# EAGLE design basic (EAGLE 9.6.2)
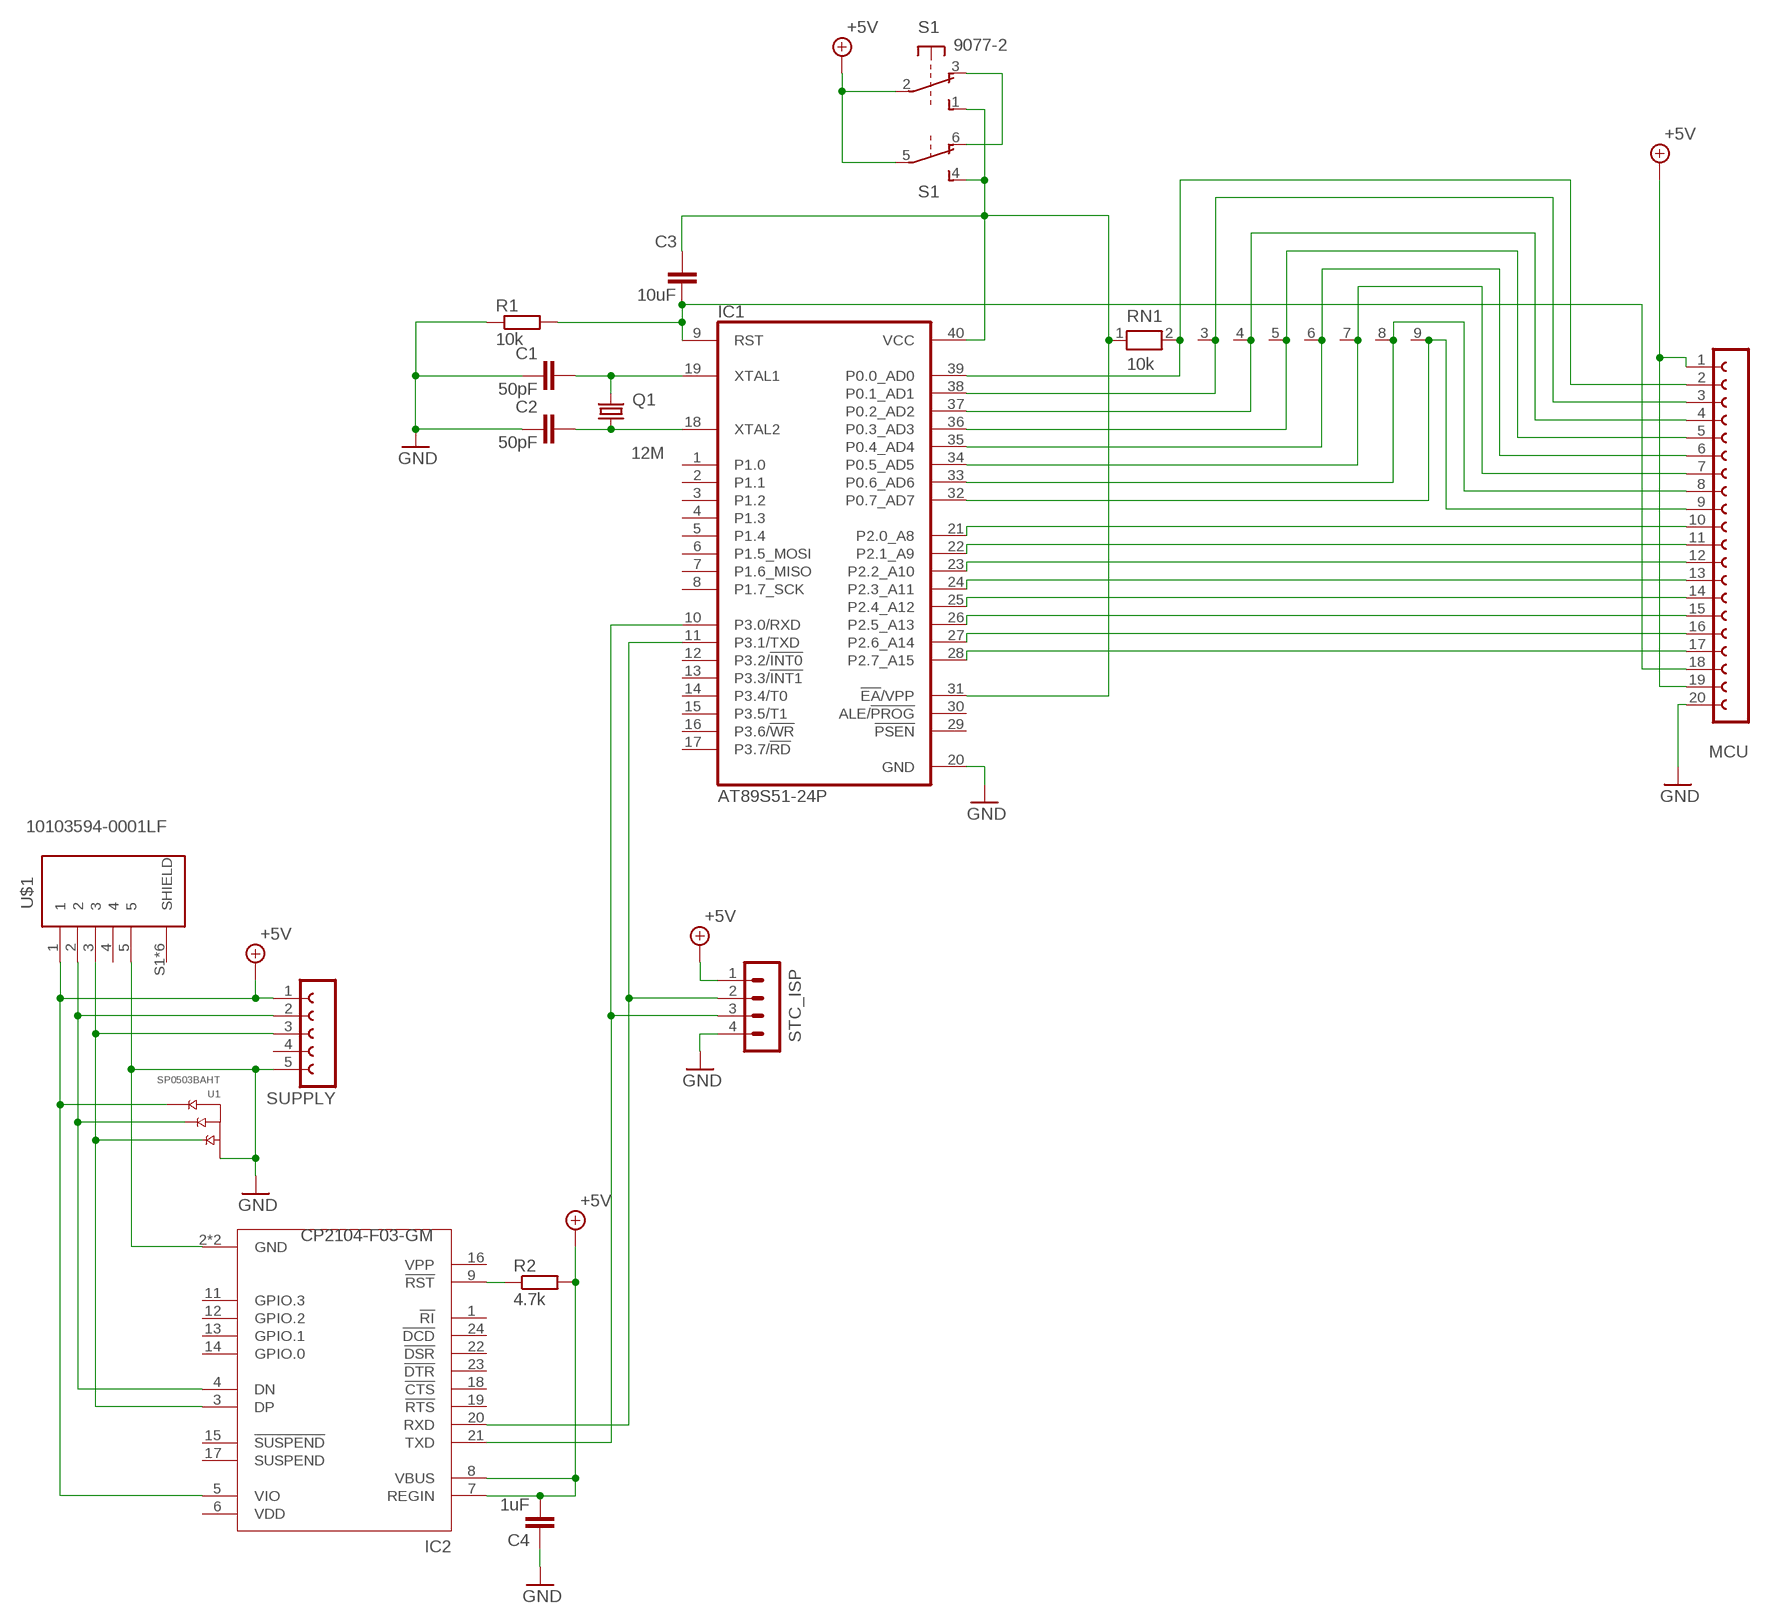
[diagram p0: schematic, sheet 1]

## Parts
C1  50pF  C-EU050-025X075  [C050-025X075]
C2  50pF  C-EU050-025X075  [C050-025X075]
C3  10uF  C-EU025-025X050  [C025-025X050]
C4  1uF  C-EU025-025X050  [C025-025X050]
IC1  AT89S51-24P  [DIL40]
IC2  CP2104-F03-GM  [QFN50P400X400X80-25N]
MCU  FE20-1  [FE20]
Q1  12M  CRYSTALHC49U70  [HC49U70]
R1  10k  R-EU_0207/10  [0207/10]
R2  4.7k  R-EU_0207/10  [0207/10]
RN1  10k  RN08  [RN-9]
S1  9077-2  [9077-2]
STC_ISP  MA04-1  [MA04-1]
SUPPLY  FE05-1  [FE05-1]
U1  SP0503BAHT  [SOT143]
U$1  10103594-0001LF  [FCI_10103594-0001LF]

## Nets
+5V: C4.2 IC2.5(VIO) IC2.7(REGIN) IC2.8(VBUS) MCU.1 MCU.19 R2.2 S1.2(1:P) S1.5(2:P) STC_ISP.1 SUPPLY.1 U1.4(C) U$1.1
GND: C1.1 C2.1 C4.1 IC1.20(GND) IC2.2(GND) IC2.25(GND) MCU.20 R1.1 STC_ISP.4 SUPPLY.5 U1.1(GND) U$1.5
N$1: IC2.4(DN) SUPPLY.2 U1.3(B) U$1.2
N$2: IC1.28(P2.7_A15) MCU.17
N$3: C1.2 IC1.19(XTAL1) Q1.2
N$4: C2.2 IC1.18(XTAL2) Q1.1
N$5: C3.2 IC1.9(RST) MCU.18 R1.2
N$6: IC1.27(P2.6_A14) MCU.16
N$7: IC1.38(P0.1_AD1) MCU.3 RN1.3
N$8: IC1.26(P2.5_A13) MCU.15
N$9: IC1.25(P2.4_A12) MCU.14
N$10: IC1.36(P0.3_AD3) MCU.5 RN1.5
N$11: IC1.35(P0.4_AD4) MCU.6 RN1.6
N$12: IC1.34(P0.5_AD5) MCU.7 RN1.7
N$13: IC1.33(P0.6_AD6) MCU.8 RN1.8
N$14: IC1.32(P0.7_AD7) MCU.9 RN1.9
N$15: IC1.24(P2.3_A11) MCU.13
N$16: IC1.23(P2.2_A10) MCU.12
N$17: IC1.22(P2.1_A9) MCU.11
N$18: IC1.10(P3.0/RXD) IC2.21(TXD) STC_ISP.3
N$19: IC1.21(P2.0_A8) MCU.10
N$20: IC2.3(DP) SUPPLY.3 U1.2(A) U$1.3
N$22: IC1.37(P0.2_AD2) MCU.4 RN1.4
N$23: S1.3(1:O) S1.6(2:O)
N$24: IC2.9(!RST!) R2.1
N$26: IC1.39(P0.0_AD0) MCU.2 RN1.2
N$27: C3.1 IC1.31(!EA!/VPP) IC1.40(VCC) RN1.1 S1.1(1:S) S1.4(2:S)
N$52: IC1.11(P3.1/TXD) IC2.20(RXD) STC_ISP.2
Unconnected: IC1.1(P1.0) IC1.2(P1.1) IC1.3(P1.2) IC1.4(P1.3) IC1.5(P1.4) IC1.6(P1.5_MOSI) IC1.7(P1.6_MISO) IC1.8(P1.7_SCK) IC1.12(P3.2/!INT0) IC1.13(P3.3/!INT1) IC1.14(P3.4/T0) IC1.15(P3.5/T1) IC1.16(P3.6/!WR) IC1.17(P3.7/!RD) IC1.29(!PSEN) IC1.30(ALE/!PROG) IC2.1(!RI) IC2.11(GPIO.3) IC2.12(GPIO.2) IC2.13(GPIO.1) IC2.14(GPIO.0) IC2.15(!SUSPEND!) IC2.16(VPP) IC2.17(SUSPEND) IC2.18(!CTS) IC2.19(!RTS) IC2.22(!DSR) IC2.23(!DTR) IC2.24(!DCD) SUPPLY.4 U$1.4 U$1.S1(SHIELD) U$1.S2(SHIELD) U$1.S3(SHIELD) U$1.S4(SHIELD) U$1.S5(SHIELD) U$1.S6(SHIELD)

## Power pins joined to a net without a drawn wire
VDD: IC2.6(VDD)

## Library data of the parts
C1-C4 = rcl:C-EU: CAPACITOR, European symbol; SPICEPREFIX: C
IC1 = atmel:AT89S51-*: 8-bit Microcontroller with 4K BytesIn-System Programmable Flash Source: http://www.atmel.com/dyn/resources/prod_documents/doc2487.pdf; MPN: AT89S51-24PU; OC_FARNELL: 1095739; OC_NEWARK: 96K6578
IC2 = CP2104:CP2104: Silabs CP2104 USB to UART Bridge; AVAILABILITY: Unavailable; DESCRIPTION: USB Bridge, USB to UART USB 2.0 UART Interface 24-QFN (4x4); MF: Silicon Labs; MP: CP2104; PACKAGE: QFN-24 Silicon Labs; PRICE: None
MCU = con-lsta:FE20-1: FEMALE HEADER; OC_FARNELL: unknown; OC_NEWARK: unknown
Q1 = crystal:CRYSTAL: CRYSTAL; OC_FARNELL: unknown; OC_NEWARK: unknown
R1 R2 = rcl:R-EU_: RESISTOR, European symbol; SPICEPREFIX: R
RN1 = resistor-net:RN08: RESISTOR NETWORK; OC_FARNELL: unknown; OC_NEWARK: unknown
S1 = switch-misc:9077-2: MARQUARDT SWITCH 9077.0200 Distributor: Buerklin <https://www.buerklin.com/default.asp?event=ShowArtikel%2812G2822%29&l=d&jump=ArtNr_12G2822>
STC_ISP = con-lstb:MA04-1: PIN HEADER; OC_FARNELL: unknown; OC_NEWARK: unknown
SUPPLY = con-lsta:FE05-1: FEMALE HEADER; OC_FARNELL: unknown; OC_NEWARK: unknown
U1 = SP0503BAHT:SP0503BAHT; DESCRIPTION: 8.5V Clamp Ipp Tvs Diode Surface Mount SOT-143-4; DIGI-KEY_PART_NUMBER: F2715TR-ND; MF: Littelfuse Inc.; MP: SP0503BAHT; PACKAGE: SOT-143 Littelfuse
U$1 = 10103594-0001LF:10103594-0001LF: Micro Usb, 2.0 Type b, Receptacle, Smt; ARROW_ELECTRONICS-PURCHASE-URL: https://snapeda.com/shop?store=Arrow+Electronics&id=1078241; DESCRIPTION: USB - micro B USB 2.0 Receptacle Connector 5 Position Surface Mount, Right Angle; Through Hole; DIGI-KEY_PART_NUMBER: 609-4050-1-ND; DIGIKEY-PURCHASE-URL: https://snapeda.com/shop?store=DigiKey&id=1078241; MF: Amphenol ICC; MOUSER-PURCHASE-URL: https://snapeda.com/shop?store=Mouser&id=1078241; MP: 10103594-0001LF; PACKAGE: None

## Board
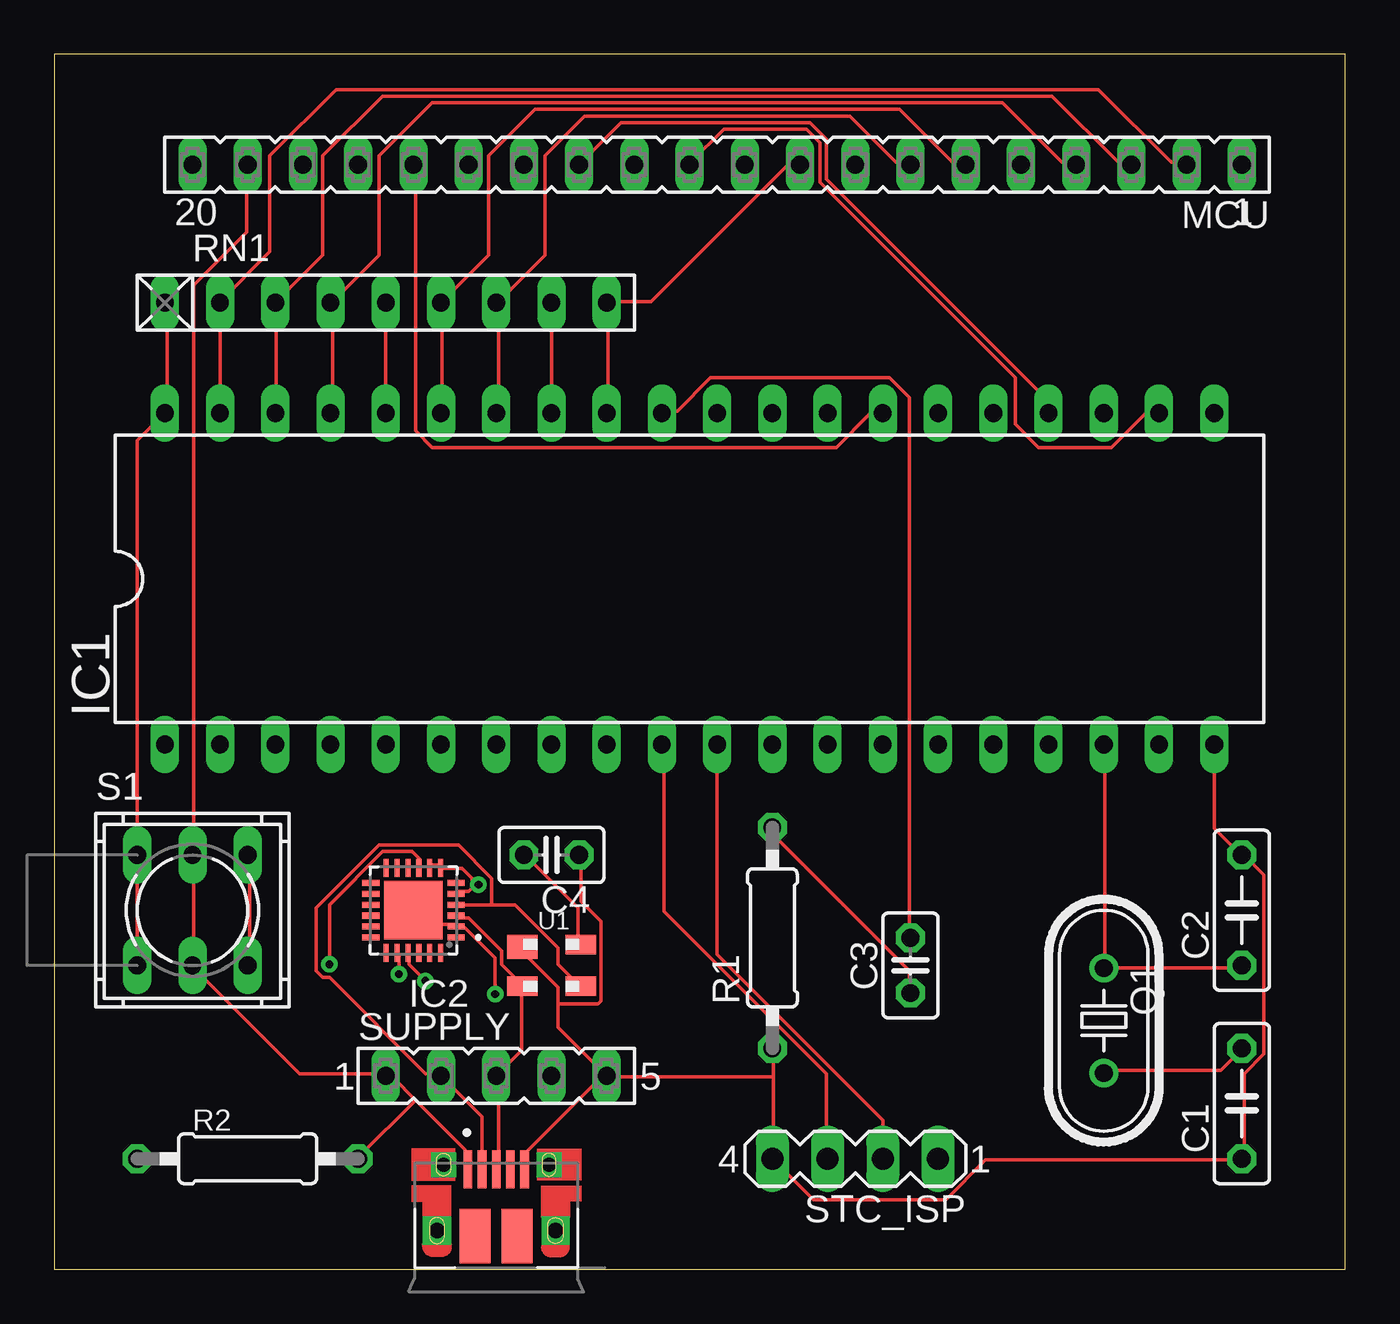
[diagram p1: board, top side]
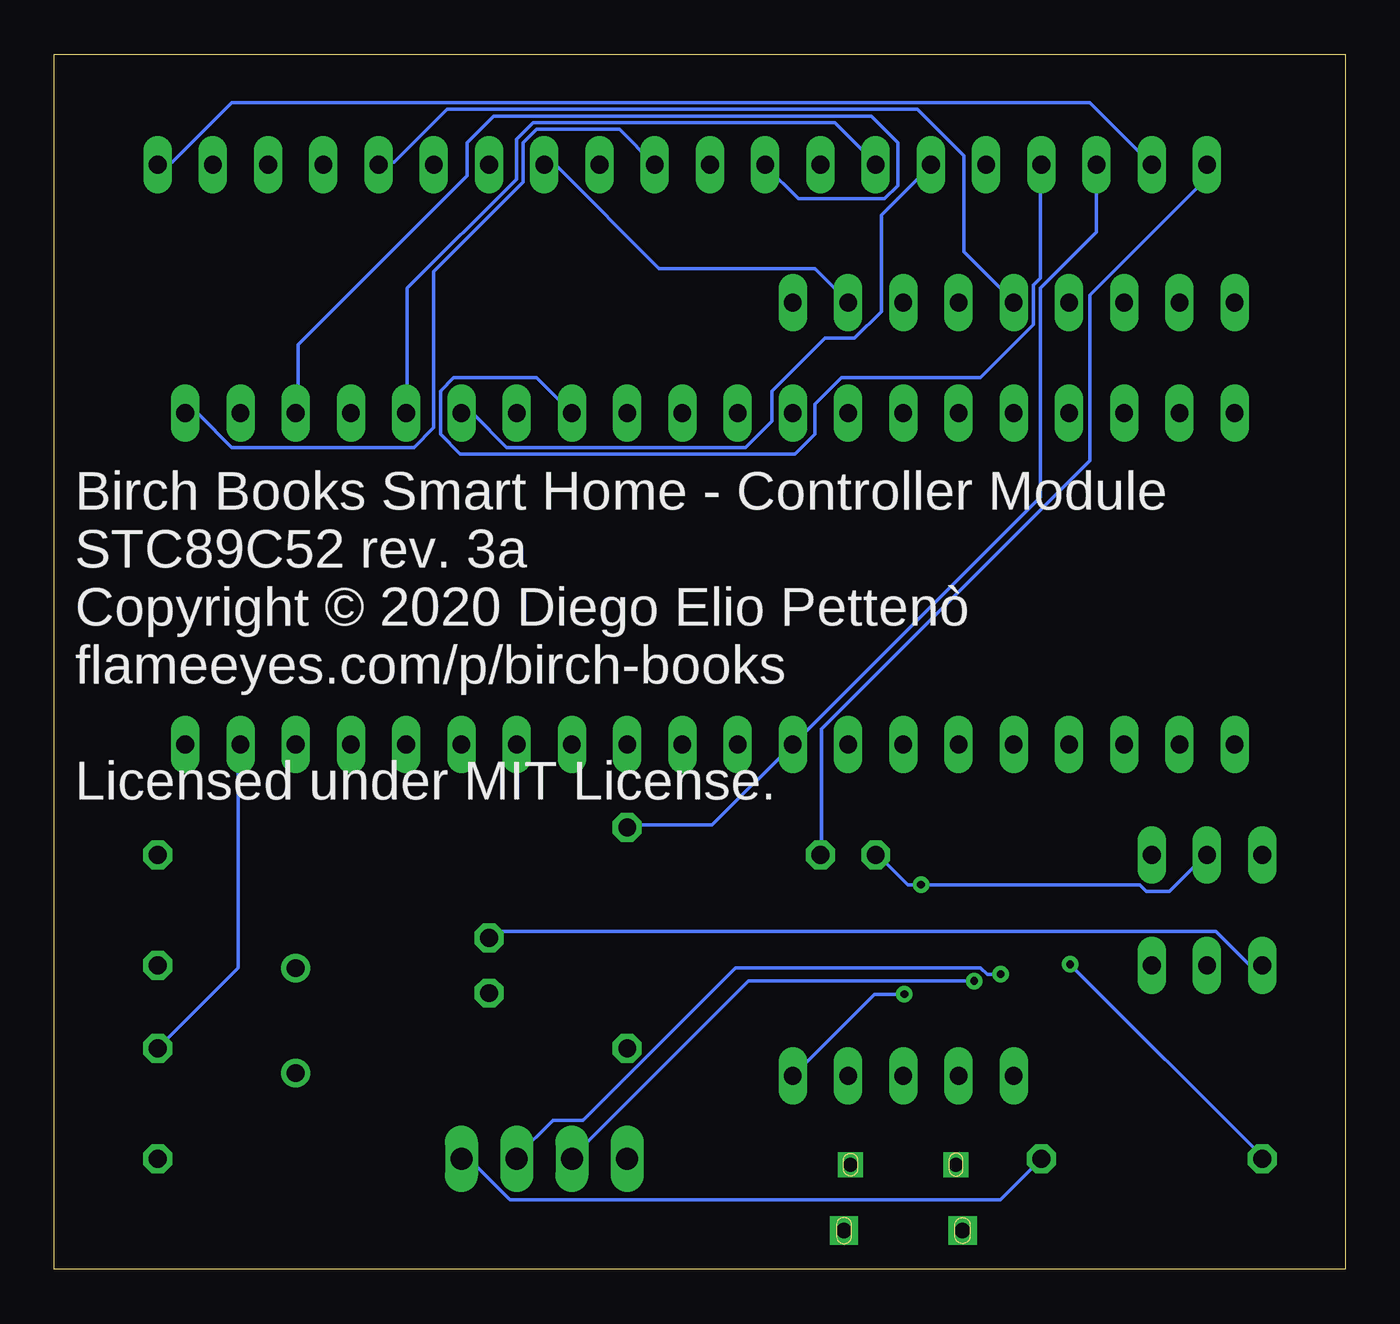
[diagram p2: board, bottom side, seen from below]

Size 59.36 x 55.87 mm. Coordinates in mm from the lower left corner, seen from the top.
Outline: 0,0 59.36,0 59.36,55.87 0,55.87 0,0
Copper layers (1*16): Top 0.035mm / dielectric 1.5mm / Bottom 0.035mm
Design rules "default": minimum track width 6mil, minimum drill 0.35mm, track to track 6mil, track to pad 6mil, pad to pad 6mil, via to via 6mil, smd to smd 6mil, copper to edge 40mil, drill to drill 6mil, minimum pad ring 10mil, minimum via ring 8mil, stop-mask expansion 4mil, vias tented up to drill 0mil, thermal gap 10mil

### Footprints (pad centres in the part's own frame; a part is rotated, then mirrored left to right if it is on the bottom)
C050-025X075 = drill 0.813 octagon: 1 -2.54,0; 2 2.54,0
C025-025X050 = drill 0.813 octagon: 1 -1.27,0; 2 1.27,0
DIL40 = drill 0.813 long: 1 -24.13,-7.62; 2 -21.59,-7.62; 3 -19.05,-7.62; 4 -16.51,-7.62; 5 -13.97,-7.62; 6 -11.43,-7.62; 7 -8.89,-7.62; 8 -6.35,-7.62; 9 -3.81,-7.62; 10 -1.27,-7.62; 11 1.27,-7.62; 12 3.81,-7.62; 13 6.35,-7.62; 14 8.89,-7.62; 15 11.43,-7.62; 16 13.97,-7.62; 17 16.51,-7.62; 18 19.05,-7.62; 19 21.59,-7.62; 20 24.13,-7.62; 21 24.13,7.62; 22 21.59,7.62; 23 19.05,7.62; 24 16.51,7.62; 25 13.97,7.62; 26 11.43,7.62; 27 8.89,7.62; 28 6.35,7.62; 29 3.81,7.62; 30 1.27,7.62; 31 -1.27,7.62; 32 -3.81,7.62; 33 -6.35,7.62; 34 -8.89,7.62; 35 -11.43,7.62; 36 -13.97,7.62; 37 -16.51,7.62; 38 -19.05,7.62; 39 -21.59,7.62; 40 -24.13,7.62
QFN50P400X400X80-25N = smd 0.81 x 0.26: 1 -1.955,1.25; 2 -1.955,0.75; 3 -1.955,0.25; 4 -1.955,-0.25; 5 -1.955,-0.75; 6 -1.955,-1.25; 13 1.955,-1.25; 14 1.955,-0.75; 15 1.955,-0.25; 16 1.955,0.25; 17 1.955,0.75; 18 1.955,1.25 | smd 0.26 x 0.81: 7 -1.25,-1.955; 8 -0.75,-1.955; 9 -0.25,-1.955; 10 0.25,-1.955; 11 0.75,-1.955; 12 1.25,-1.955; 19 1.25,1.955; 20 0.75,1.955; 21 0.25,1.955; 22 -0.25,1.955; 23 -0.75,1.955; 24 -1.25,1.955 | smd 2.68 x 2.68: 25 0,0
FE20 = drill 0.813 long: 1 -24.13,0; 2 -21.59,0; 3 -19.05,0; 4 -16.51,0; 5 -13.97,0; 6 -11.43,0; 7 -8.89,0; 8 -6.35,0; 9 -3.81,0; 10 -1.27,0; 11 1.27,0; 12 3.81,0; 13 6.35,0; 14 8.89,0; 15 11.43,0; 16 13.97,0; 17 16.51,0; 18 19.05,0; 19 21.59,0; 20 24.13,0
HC49U70 = drill 0.813: 1 -2.413,0; 2 2.413,0
0207/10 = drill 0.813 octagon: 1 -5.08,0; 2 5.08,0
RN-9 = drill 0.813 long: 1 -10.16,0; 2 -7.62,0; 3 -5.08,0; 4 -2.54,0; 5 0,0; 6 2.54,0; 7 5.08,0; 8 7.62,0; 9 10.16,0
9077-2 = drill 0.813 long: 1 -2.54,2.54; 2 0,2.54; 3 2.54,2.54; 4 -2.54,-2.54; 5 0,-2.54; 6 2.54,-2.54
MA04-1 = drill 1.016 long: 1 -3.81,0; 2 -1.27,0; 3 1.27,0; 4 3.81,0
FE05-1 = drill 0.813 long: 1 -5.08,0; 2 -2.54,0; 3 0,0; 4 2.54,0; 5 5.08,0
SOT143 = smd 1.4 x 1.1: 1 -1.35,0.86 | smd 1.4 x 0.9: 2 -1.35,-0.96; 3 1.35,-0.96; 4 1.35,0.96
FCI_10103594-0001LF = smd 0.4 x 1.75: 1 -1.3,2.825; 2 -0.65,2.825; 3 0,2.825; 4 0.65,2.825; 5 1.3,2.825 | smd 1.425 x 2.5: S1 -0.963,-0.25; S2 0.963,-0.25 | drill 0.65 pad 1.05 square: S3 -2.425,3.03; S4 2.425,3.03 | drill 0.7 pad 1.3 square: S5 -2.725,0; S6 2.725,0

### Placement (x,y rotation side)
C1  54.61,7.62 90 top
C2  54.61,16.51 270 top
C3  39.37,13.97 270 top
C4  22.86,19.05 180 top
IC1  29.21,31.75 0 top
IC2  16.51,16.51 180 top
MCU  30.48,50.8 180 top
Q1  48.26,11.43 270 top
R1  33.02,15.24 90 top
R2  8.89,5.08 0 top
RN1  15.24,44.45 0 top
S1  6.35,16.51 0 top
STC_ISP  36.83,5.08 180 top
SUPPLY  20.32,8.89 0 top
U1  22.86,13.97 0 top
U$1  20.32,1.78 0 top

### Tracks (layer width: path | path; a pad name or v marks a point on that pad's centre or on a via)
+5V  (via drill 0.35)
  Top 0.152: 16.61,7.77 15.54,8.84 15.24,8.84 SUPPLY.1 15.24,8.99 11.28,8.99 6.4,13.87 S1.5 6.4,14.02 6.4,19.05 | 16.61,7.77 18.9,5.49 18.9,4.72 U$1.1 | 16.61,7.77 14.02,5.18 R2.2 | IC2.8 17.37,18.59 17.68,18.59 IC2.7 17.83,18.44 18.75,18.44 19.2,17.98 19.2,17.68 | 19.2,17.68 19.2,17.53 19.05,17.37 18.59,17.37 IC2.5 | U1.4 24.08,14.94 24.08,16.61 21.64,19.05 C4.2 | v19.51,17.68 19.2,17.68 | 6.4,19.05 6.4,45.26 8.84,47.7 8.84,50.75 MCU.19 | 6.4,19.05 S1.2
  Bottom 0.152: R2.2 15.85,3.2 38.41,3.2 40.23,5.03 40.54,5.03 STC_ISP.1 | C4.2 21.49,19.05 20.12,17.68 v19.51,17.68 9.45,17.68 9.14,17.37 8.08,17.37 6.4,19.05 S1.2 | MCU.19 11.73,53.65 51.21,53.65 53.95,50.9 54.56,50.9 MCU.1
GND  (via drill 0.35)
  Top 0.152: IC1.20 53.34,20.27 54.56,19.05 C2.1 54.71,19.05 55.63,18.14 55.63,9.91 54.71,8.99 54.71,5.18 C1.1 54.56,5.03 42.82,5.03 41,3.2 34.9,3.2 STC_ISP.4 33.07,5.18 33.07,8.84 | 33.07,8.84 33.07,10.06 R1.1 | IC2.25 16.61,16.46 17.22,15.85 18.44,15.85 IC2.2 18.59,15.7 18.9,15.7 20.27,14.33 v20.27,12.65 | 23.16,12.19 23.16,11.12 25.3,8.99 | 23.16,12.19 23.16,12.95 21.64,14.48 21.64,14.78 U1.1 | 25.3,8.99 21.64,5.33 21.64,4.72 U$1.5 | 25.3,8.99 SUPPLY.5 25.45,8.84 33.07,8.84 | 23.16,12.19 24.99,12.19 25.15,12.34 25.15,16 24.23,16.92 24.23,19.05 C4.1
  Bottom 0.152: MCU.20 6.4,50.75 6.4,50.14 11.73,44.81 11.73,37.19 24.08,24.84 24.08,19.05 C4.1 | v20.27,12.65 21.64,12.65 SUPPLY.5
N$1
  Top 0.152: U$1.2 19.66,4.72 19.66,7.01 SUPPLY.2 17.68,8.99 17.07,8.99 12.65,13.41 12.34,13.41 12.04,13.72 12.04,16.61 14.94,19.51 18.59,19.51 20.12,17.98 20.12,16.76 | 20.12,16.76 21.18,16.76 23.16,14.78 23.16,14.02 24.08,13.11 U1.3 | 20.12,16.76 18.59,16.76 IC2.4
N$2
  Bottom 0.152: IC1.28 37.19,41 41,41 41.6,40.39 41.6,38.41 40.69,37.49 25.3,37.49 24.38,38.41 24.38,39.78 23.16,41 16.76,41 14.33,43.43 14.33,45.26 14.02,45.57 14.02,50.75 MCU.17
N$3
  Top 0.152: Q1.2 48.31,9.14 53.65,9.14 54.56,10.06 C1.2
  Bottom 0.152: C1.2 50.9,13.87 50.9,24.08 IC1.19
N$4
  Top 0.152: 48.31,13.87 54.56,13.87 C2.2 | 48.31,13.87 48.31,24.08 IC1.18 | 48.31,13.87 Q1.1
N$5
  Top 0.152: C3.2 39.32,12.8 39.32,13.72 33.07,19.96 33.07,20.27 R1.2
  Bottom 0.152: MCU.18 11.43,47.7 14.02,45.11 14.02,35.51 IC1.9 29.11,20.42 32.92,20.42 R1.2
N$6
  Top 0.152: IC1.27 38.1,39.32 37.49,39.32 35.97,37.8 17.37,37.8 16.61,38.56 16.61,50.75 MCU.16
N$7
  Top 0.152: IC1.38 10.21,39.47 10.21,44.35 RN1.3 12.34,46.63 12.34,51.21 15.09,53.95 45.87,53.95 48.92,50.9 49.53,50.9 MCU.3
N$8
  Bottom 0.152: IC1.26 40.54,39.32 40.08,39.32 38.56,37.8 27.58,37.8 26.36,39.01 26.36,40.39 23.93,42.82 22.55,42.82 21.34,44.04 21.34,48.46 19.05,50.75 MCU.15
N$9
  Bottom 0.152: IC1.25 43.13,39.47 43.13,45.11 38.1,50.14 38.1,51.97 37.34,52.73 23.47,52.73 21.64,50.9 MCU.14
N$10
  Top 0.152: RN1.5 IC1.36
  Bottom 0.152: MCU.5 44.35,50.9 43.74,50.9 41.3,53.34 19.66,53.34 17.53,51.21 17.53,46.79 15.24,44.5 RN1.5
N$11
  Top 0.152: IC1.35 17.83,39.47 17.83,44.35 RN1.6 19.96,46.63 19.96,51.21 22.1,53.34 38.86,53.34 41.3,50.9 41.91,50.9 MCU.6
N$12
  Top 0.152: IC1.34 20.42,39.47 20.42,44.35 RN1.7 20.42,44.5 22.55,46.63 22.55,51.21 24.38,53.03 36.58,53.03 38.71,50.9 39.32,50.9 MCU.7
N$13
  Top 0.152: RN1.8 IC1.33
  Bottom 0.152: MCU.8 36.73,50.75 36.27,50.75 31.55,46.02 24.38,46.02 22.86,44.5 RN1.8
N$14
  Top 0.152: IC1.32 25.45,39.47 25.45,44.35 RN1.9 25.45,44.5 27.43,44.5 33.68,50.75 34.29,50.75 MCU.9
N$15
  Top 0.152: IC1.24 45.72,39.93 35.51,50.14 35.51,51.97 34.75,52.73 26.06,52.73 MCU.13
N$16
  Bottom 0.152: IC1.23 48.16,39.47 48.16,42.52 40.39,50.29 40.39,51.82 39.17,53.03 21.79,53.03 20.57,51.82 20.57,49.84 21.18,49.23 25.15,49.23 26.67,50.75 MCU.12
N$17
  Top 0.152: IC1.22 50.75,39.32 50.14,39.32 48.62,37.8 45.26,37.8 44.2,38.86 44.2,41 35.2,49.99 35.2,51.82 34.59,52.43 30.79,52.43 29.26,50.9 MCU.11
N$18  (via drill 0.35)
  Top 0.152: v17.07,13.26 16.31,14.02 16.31,14.48 IC2.21 | IC1.10 28.04,24.08 28.04,16.46 35.51,8.99 35.51,5.18 STC_ISP.3
  Bottom 0.152: v17.07,13.26 27.43,13.26 35.51,5.18 STC_ISP.3
N$19
  Bottom 0.152: MCU.10 33.38,52.43 37.19,52.43 37.8,51.82 37.8,49.99 41.91,45.87 41.91,38.71 42.82,37.8 51.21,37.8 52.73,39.32 53.34,39.32 IC1.21
N$20
  Top 0.152: IC2.3 18.59,16.15 19.05,16.15 20.57,14.63 20.57,14.02 21.49,13.11 U1.2 21.49,12.95 21.49,10.06 SUPPLY.3 20.42,8.84 20.42,4.72 U$1.3
N$22
  Top 0.152: IC1.37 12.8,39.47 12.8,44.35 RN1.4 12.8,44.5 14.94,46.63 14.94,51.21 17.37,53.65 43.59,53.65 46.33,50.9 46.94,50.9 MCU.4
N$23
  Top 0.152: S1.6 8.99,14.02 8.99,19.05 S1.3
N$24  (via drill 0.35)
  Top 0.152: v12.65,14.02 12.65,16.76 15.09,19.2 16.46,19.2 16.76,18.9 16.76,18.59 IC2.9
  Bottom 0.152: v12.65,14.02 3.81,5.18 R2.1
N$26
  Top 0.152: IC1.39 RN1.2 7.62,44.5 9.91,46.79 9.91,51.21 12.95,54.25 48.01,54.25 51.36,50.9 51.97,50.9 MCU.2
N$27
  Top 0.152: S1.4 S1.1 3.81,38.1 IC1.40 5.18,39.47 5.18,44.35 RN1.1 | IC1.31 28.04,39.47 28.65,39.47 30.18,41 38.41,41 39.32,40.08 39.32,15.24 C3.1
  Bottom 0.152: S1.4 3.81,14.02 4.42,14.02 5.94,15.54 39.01,15.54 39.32,15.24 C3.1
N$52  (via drill 0.35)
  Top 0.152: v15.85,13.56 15.85,14.48 IC2.20 | IC1.11 30.48,14.48 38.1,6.86 STC_ISP.2
  Bottom 0.152: v15.85,13.56 16.46,13.56 16.76,13.87 28.04,13.87 35.05,6.86 36.42,6.86 38.1,5.18 STC_ISP.2

### Text on the board
bPlace: Birch Books Smart Home - Controller Module / STC89C52 rev. 3a / Copyright © 2020 Diego Elio Pettenò / flameeyes.com/p/birch-books / / Licensed under MIT License.